# EAGLE design e-Tapperhandpiece (EAGLE 8.2.2)
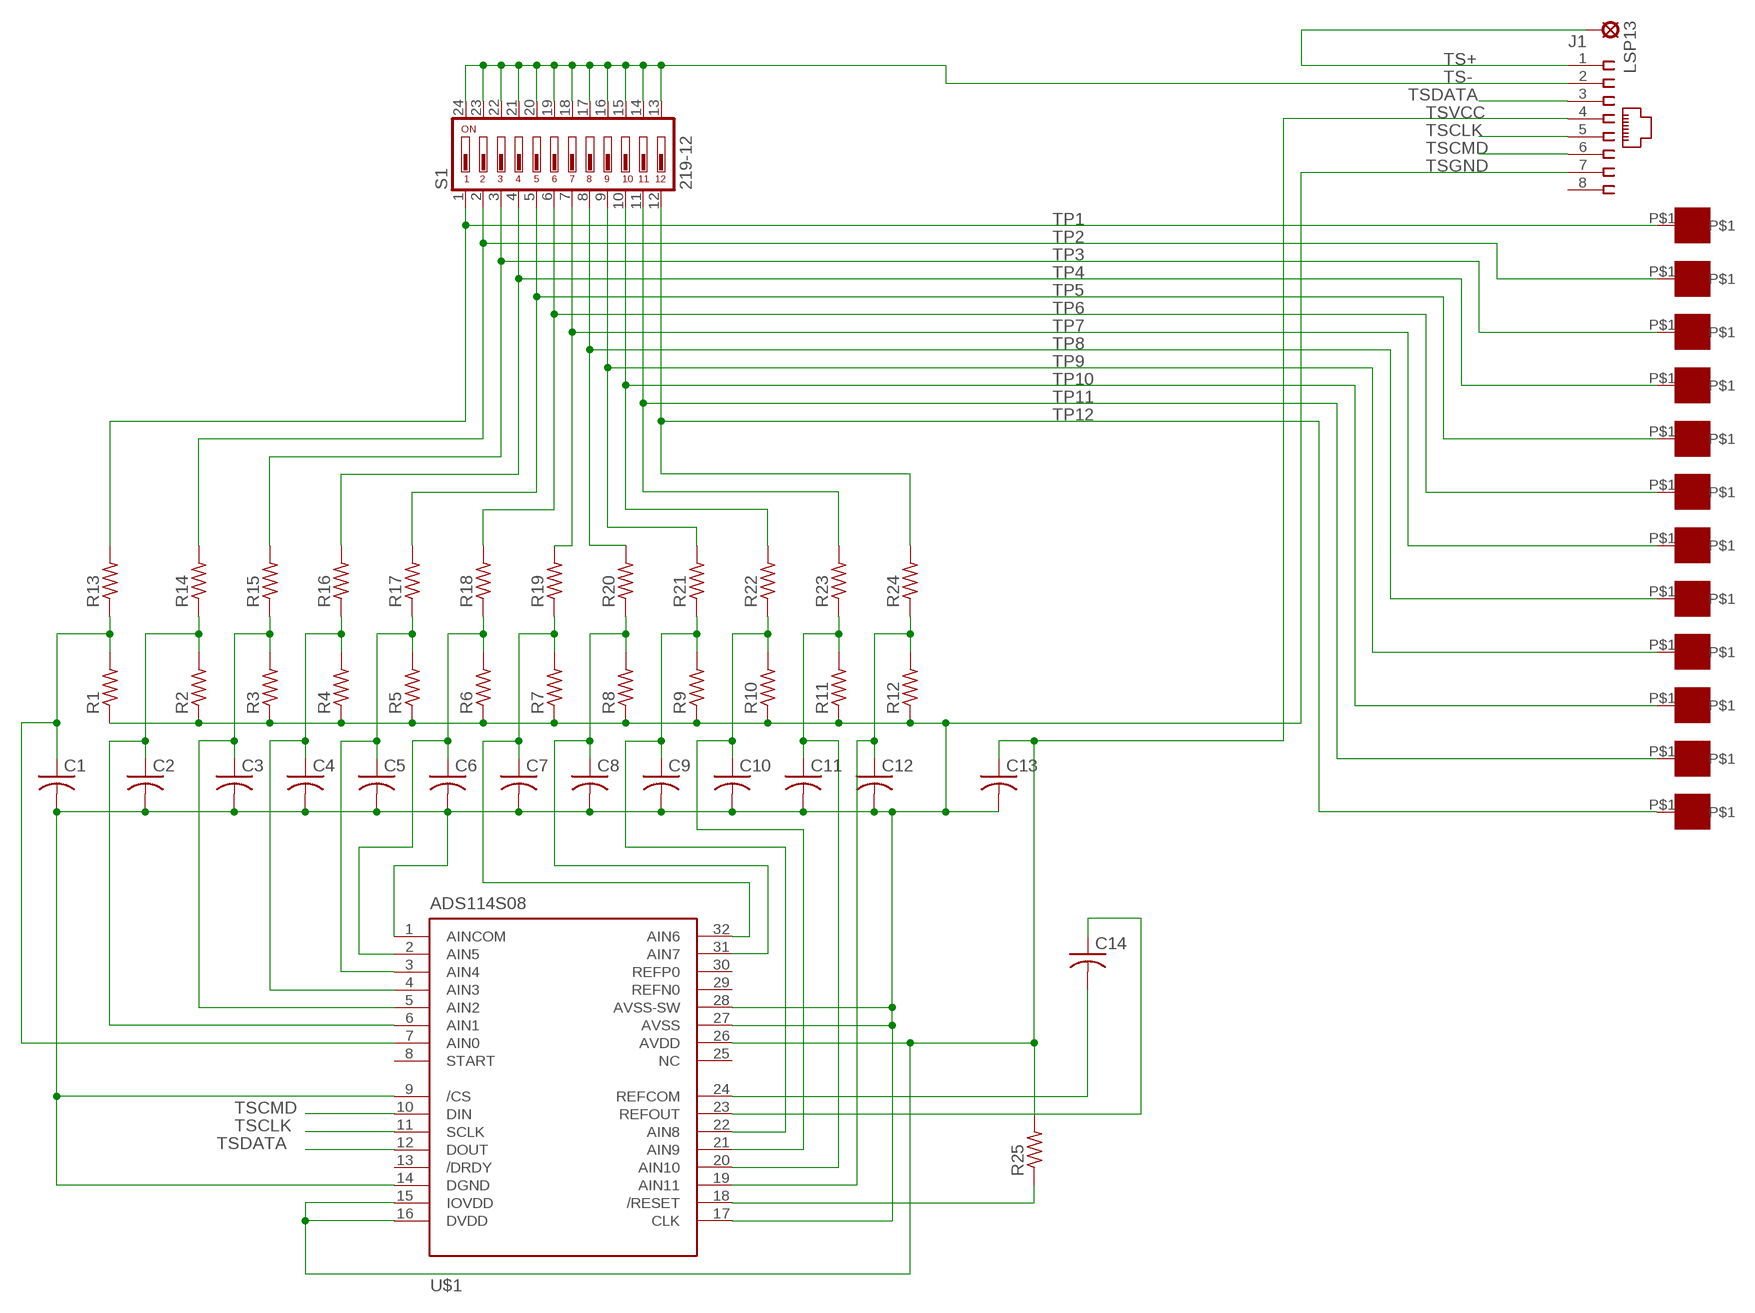
[diagram p0: schematic, sheet 1]

## Parts
C1  C-USC0805  [C0805]
C2  C-USC0805  [C0805]
C3  C-USC0805  [C0805]
C4  C-USC0805  [C0805]
C5  C-USC0805  [C0805]
C6  C-USC0805  [C0805]
C7  C-USC0805  [C0805]
C8  C-USC0805  [C0805]
C9  C-USC0805  [C0805]
C10  C-USC0805  [C0805]
C11  C-USC0805  [C0805]
C12  C-USC0805  [C0805]
C13  C-USC0805  [C0805]
C14  C-USC0805  [C0805]
J1  215877-4  [215877-4]
LSP13  SE11  [SE11]
R1  R-US_R0402  [R0402]
R2  R-US_R0402  [R0402]
R3  R-US_R0402  [R0402]
R4  R-US_R0402  [R0402]
R5  R-US_R0402  [R0402]
R6  R-US_R0402  [R0402]
R7  R-US_R0402  [R0402]
R8  R-US_R0402  [R0402]
R9  R-US_R0402  [R0402]
R10  R-US_R0402  [R0402]
R11  R-US_R0402  [R0402]
R12  R-US_R0402  [R0402]
R13  R-US_R0402  [R0402]
R14  R-US_R0402  [R0402]
R15  R-US_R0402  [R0402]
R16  R-US_R0402  [R0402]
R17  R-US_R0402  [R0402]
R18  R-US_R0402  [R0402]
R19  R-US_R0402  [R0402]
R20  R-US_R0402  [R0402]
R21  R-US_R0402  [R0402]
R22  R-US_R0402  [R0402]
R23  R-US_R0402  [R0402]
R24  R-US_R0402  [R0402]
R25  R-US_R0402  [R0402]
S1  219-12  [CTS-219-12]
TSP1  ET1  [ET1]
TSP2  ET1  [ET1]
TSP3  ET1  [ET1]
TSP4  ET1  [ET1]
TSP5  ET1  [ET1]
TSP6  ET1  [ET1]
TSP7  ET1  [ET1]
TSP8  ET1  [ET1]
TSP9  ET1  [ET1]
TSP10  ET1  [ET1]
TSP11  ET1  [ET1]
TSP12  ET1  [ET1]
U$1  ADS114S08  [TQFP32-08]

## Nets
N$10: R25.1 U$1.18(/RESET)
N$14: C1.1 R1.2 R13.1 U$1.7(AIN0)
N$15: C2.1 R2.2 R14.1 U$1.6(AIN1)
N$16: C3.1 R3.2 R15.1 U$1.5(AIN2)
N$17: C4.1 R4.2 R16.1 U$1.4(AIN3)
N$18: C5.1 R5.2 R17.1 U$1.3(AIN4)
N$19: C6.1 R6.2 R18.1 U$1.2(AIN5)
N$20: C7.1 R7.2 R19.1 U$1.32(AIN6)
N$21: C8.1 R8.2 R20.1 U$1.31(AIN7)
N$22: C9.1 R9.2 R21.1 U$1.22(AIN8)
N$23: C10.1 R10.2 R22.1 U$1.21(AIN9)
N$24: C11.1 R11.2 R23.1 U$1.20(AIN10)
N$25: C12.1 R12.2 R24.1 U$1.19(AIN11)
REFCOM: C14.2 U$1.24(REFCOM)
REFOUT: C14.1 U$1.23(REFOUT)
TP1: R13.2 S1.1 TSP1.P$1
TP2: R14.2 S1.2 TSP2.P$1
TP3: R15.2 S1.3 TSP3.P$1
TP4: R16.2 S1.4 TSP4.P$1
TP5: R17.2 S1.5 TSP5.P$1
TP6: R18.2 S1.6 TSP6.P$1
TP7: R19.2 S1.7 TSP7.P$1
TP8: R20.2 S1.8 TSP8.P$1
TP9: R21.2 S1.9 TSP9.P$1
TP10: R22.2 S1.10 TSP10.P$1
TP11: R23.2 S1.11 TSP11.P$1
TP12: R24.2 S1.12 TSP12.P$1
TS+: J1.1 LSP13.MP
TS-: J1.2 S1.13 S1.14 S1.15 S1.16 S1.17 S1.18 S1.19 S1.20 S1.21 S1.22 S1.23 S1.24
TSCLK: J1.5 U$1.11(SCLK)
TSCMD: J1.6 U$1.10(DIN)
TSDATA: J1.3 U$1.12(DOUT)
TSGND: C1.2 C2.2 C3.2 C4.2 C5.2 C6.2 C7.2 C8.2 C9.2 C10.2 C11.2 C12.2 C13.2 J1.7 R1.1 R2.1 R3.1 R4.1 R5.1 R6.1 R7.1 R8.1 R9.1 R10.1 R11.1 R12.1 U$1.1(AINCOM) U$1.9(/CS) U$1.14(DGND) U$1.17(CLK) U$1.27(AVSS) U$1.28(AVSS-SW)
TSVCC: C13.1 J1.4 R25.2 U$1.15(IOVDD) U$1.16(DVDD) U$1.26(AVDD)
Unconnected: J1.8 U$1.8(START) U$1.13(/DRDY) U$1.25(NC) U$1.29(REFN0) U$1.30(REFP0)

## Library data of the parts
C1-C14 = rcl:C-US: CAPACITOR, American symbol
J1 = con-amp:215877-4: AMP connector
LSP13 = solpad:SE11: SOLDER PAD RTM, drill 1,1mm, distributor Buerklin, 07F810
R1-R25 = resistor:R-US_: RESISTOR, American symbol
S1 = switch-dil:219-12*: Surface Mount DIP Switch Series 219 SMT CTS Electronic Components Sourc: www.ctscorp.com; OC_FARNELL: unknown; OC_NEWARK: unknown
TSP1-TSP12 = ET1:ET1: Through Hold Pads 20 mil drill hole
U$1 = ADS114S08:ADS114S08

## Net classes
0 default: clearance 0.205 mm

## Board
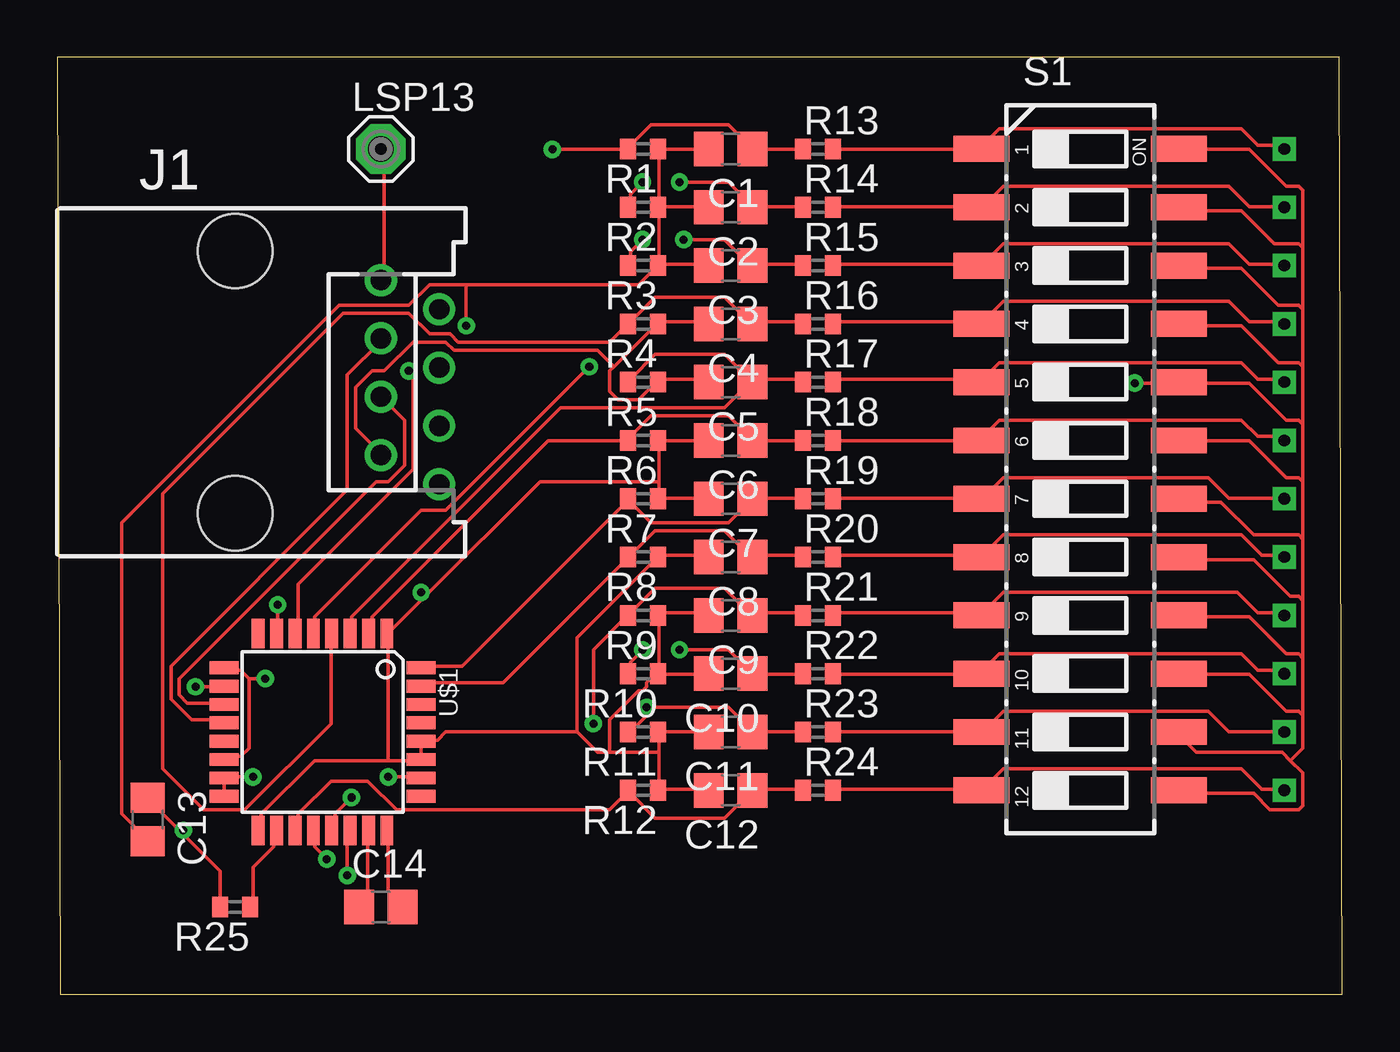
[diagram p1: board, top side]
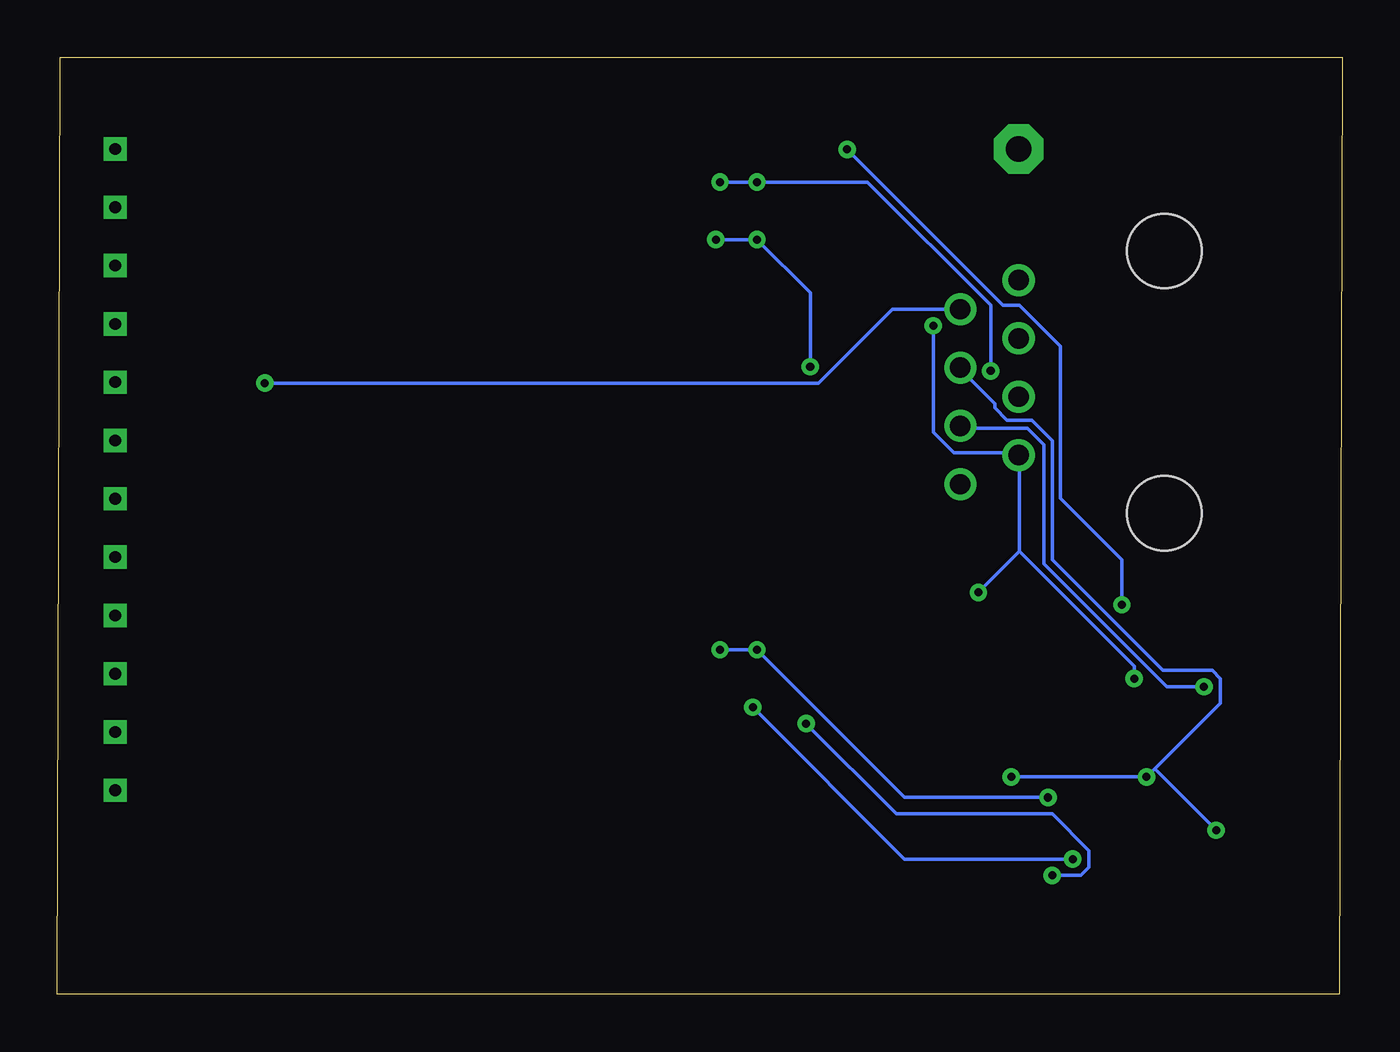
[diagram p2: board, bottom side, seen from below]

Size 55.99 x 40.82 mm. Coordinates in mm from the lower left corner, seen from the top.
Outline: 0.13,0 55.99,0 55.86,40.82 0,40.82 0.13,0
Copper layers (1*16): Top 0.035mm / dielectric 1.5mm / Bottom 0.035mm
Design rules "e-Tapperhandpiece": minimum track width 6mil, minimum drill 0.35mm, track to track 0.205mm, track to pad 0.205mm, pad to pad 0.205mm, via to via 0.205mm, smd to smd 6mil, copper to edge 40mil, drill to drill 6mil, minimum pad ring 10mil, minimum via ring 8mil, stop-mask expansion 4mil, vias tented up to drill 0mil, thermal gap 10mil

### Footprints (pad centres in the part's own frame; a part is rotated, then mirrored left to right if it is on the bottom)
C0805 = smd 1.3 x 1.5: 1 -0.95,0; 2 0.95,0
215877-4 = drill 0.889: 1 -4.445,6.35; 2 -3.175,8.89; 3 -1.905,6.35; 4 -0.635,8.89; 5 0.635,6.35; 6 1.905,8.89; 7 3.175,6.35; 8 4.445,8.89 | hole 3.251: -5.715,0; 5.715,0
SE11 = drill 1.118 pad 2.159 octagon: MP 0,0
R0402 = smd 0.7 x 0.9: 1 -0.65,0; 2 0.65,0
CTS-219-12 = smd 1.13 x 2.44: 1 -13.97,-4.3; 2 -11.43,-4.3; 3 -8.89,-4.3; 4 -6.35,-4.3; 5 -3.81,-4.3; 6 -1.27,-4.3; 7 1.27,-4.3; 8 3.81,-4.3; 9 6.35,-4.3; 10 8.89,-4.3; 11 11.43,-4.3; 12 13.97,-4.3; 13 13.97,4.3; 14 11.43,4.3; 15 8.89,4.3; 16 6.35,4.3; 17 3.81,4.3; 18 1.27,4.3; 19 -1.27,4.3; 20 -3.81,4.3; 21 -6.35,4.3; 22 -8.89,4.3; 23 -11.43,4.3; 24 -13.97,4.3
ET1 = drill 0.508 square: P$1 0,0
TQFP32-08 = smd 1.27 x 0.559: 1 -4.293,2.8; 2 -4.293,2; 3 -4.293,1.2; 4 -4.293,0.4; 5 -4.293,-0.4; 6 -4.293,-1.2; 7 -4.293,-2; 8 -4.293,-2.8; 17 4.293,-2.8; 18 4.293,-2; 19 4.293,-1.2; 20 4.293,-0.4; 21 4.293,0.4; 22 4.293,1.2; 23 4.293,2; 24 4.293,2.8 | smd 0.559 x 1.27: 9 -2.8,-4.293; 10 -2,-4.293; 11 -1.2,-4.293; 12 -0.4,-4.293; 13 0.4,-4.293; 14 1.2,-4.293; 15 2,-4.293; 16 2.8,-4.293; 25 2.8,4.293; 26 2,4.293; 27 1.2,4.293; 28 0.4,4.293; 29 -0.4,4.293; 30 -1.2,4.293; 31 -2,4.293; 32 -2.8,4.293

### Placement (x,y rotation side)
C1  29.34,36.83 180 top
C2  29.34,34.29 180 top
C3  29.34,31.75 180 top
C4  29.34,29.21 180 top
C5  29.34,26.67 180 top
C6  29.34,24.13 180 top
C7  29.34,21.59 180 top
C8  29.34,19.05 180 top
C9  29.34,16.51 180 top
C10  29.34,13.97 180 top
C11  29.34,11.43 180 top
C12  29.34,8.89 180 top
C13  3.94,7.62 270 top
C14  14.1,3.81 0 top
DRILEGEND  [DRILEGEND]  -0.1,-3.81 0 top  (outside the outline)
J1  7.75,26.67 270 top
LSP13  14.1,36.83 0 top
R1  25.53,36.83 180 top
R2  25.53,34.29 180 top
R3  25.53,31.75 180 top
R4  25.53,29.21 180 top
R5  25.53,26.67 180 top
R6  25.53,24.13 180 top
R7  25.53,21.59 180 top
R8  25.53,19.05 180 top
R9  25.53,16.51 180 top
R10  25.53,13.97 180 top
R11  25.53,11.43 180 top
R12  25.53,8.89 180 top
R13  33.15,36.83 0 top
R14  33.15,34.29 0 top
R15  33.15,31.75 0 top
R16  33.15,29.21 0 top
R17  33.15,26.67 0 top
R18  33.15,24.13 0 top
R19  33.15,21.59 0 top
R20  33.15,19.05 0 top
R21  33.15,16.51 0 top
R22  33.15,13.97 0 top
R23  33.15,11.43 0 top
R24  33.15,8.89 0 top
R25  7.75,3.81 180 top
S1  44.58,22.86 270 top
TSP1  53.47,36.83 0 top
TSP2  53.47,34.29 0 top
TSP3  53.47,31.75 0 top
TSP4  53.47,29.21 0 top
TSP5  53.47,26.67 0 top
TSP6  53.47,24.13 0 top
TSP7  53.47,21.59 0 top
TSP8  53.47,19.05 0 top
TSP9  53.47,16.51 0 top
TSP10  53.47,13.97 0 top
TSP11  53.47,11.43 0 top
TSP12  53.47,8.89 0 top
U$1  11.56,11.43 270 top

### Tracks (layer width: path | path; a pad name or v marks a point on that pad's centre or on a via)
N$10
  Top 0.152: R25.1 8.53,3.93 8.53,5.54 9.42,6.43 9.42,6.97 U$1.18
N$14  (via drill 0.35)
  Top 0.152: R13.1 32.47,36.81 30.33,36.81 C1.1 30.15,36.99 29.25,37.88 25.86,37.88 24.97,36.99 R1.2 24.79,36.81 v21.57,36.81 | v9.6,16.98 9.6,15.73 U$1.7
  Bottom 0.152: v9.6,16.98 9.6,18.94 12.28,21.62 12.28,28.23 14.07,30.02 14.78,30.02 v21.57,36.81
N$15  (via drill 0.35)
  Top 0.152: v25.5,35.38 24.97,34.85 24.97,34.31 R2.2 | v27.11,35.38 29.25,35.38 30.33,34.31 | 30.33,34.31 32.47,34.31 R14.1 | 30.33,34.31 C2.1 | v15.32,27.16 15.5,26.98 15.5,22.87 10.49,17.87 10.49,15.73 U$1.6
  Bottom 0.152: v27.11,35.38 v25.5,35.38 20.68,35.38 15.32,30.02 v15.32,27.16
N$16  (via drill 0.35)
  Top 0.152: v25.5,32.88 24.97,32.34 24.97,31.81 R3.2 | v27.29,32.88 29.08,32.88 30.15,31.81 C3.1 30.33,31.81 32.47,31.81 R15.1 | v23.18,27.34 16.92,21.09 15.85,21.09 11.21,16.44 11.21,15.73 U$1.5
  Bottom 0.152: v27.29,32.88 v25.5,32.88 23.18,30.56 v23.18,27.34
N$17
  Top 0.152: R16.1 32.47,29.31 30.33,29.31 C4.1 30.15,29.31 29.08,30.38 26.04,30.38 24.97,29.31 R4.2 24.79,29.13 24.07,28.41 17.46,28.41 17.1,28.77 16.21,28.77 15.32,29.66 12.46,29.66 4.59,21.8 4.59,9.83 6.38,8.04 8.17,8.04 11.92,11.79 11.92,15.55 U$1.4
N$18
  Top 0.152: R5.2 24.97,26.8 26.04,27.88 29.08,27.88 30.15,26.8 C5.1 | R17.1 32.47,26.8 30.33,26.8 C5.1 | U$1.3 12.82,15.73 12.82,16.44 21.93,25.55 29.08,25.55 30.15,26.63 C5.1
N$19
  Top 0.152: R18.1 32.47,24.12 30.33,24.12 C6.1 30.15,24.3 29.25,25.2 25.86,25.2 24.97,24.3 R6.2 24.79,24.12 21.39,24.12 13.71,16.44 13.71,15.73 U$1.2
N$20
  Top 0.152: R19.1 32.47,21.62 30.33,21.62 C7.1 30.15,21.44 29.25,20.55 25.86,20.55 24.97,21.44 R7.2 24.79,21.44 17.64,14.3 15.85,14.3 U$1.32
N$21
  Top 0.152: R20.1 32.47,19.12 30.33,19.12 C8.1 30.15,19.12 29.08,20.19 26.04,20.19 24.97,19.12 R8.2 24.79,18.94 19.43,13.58 15.85,13.58 U$1.31
N$22  (via drill 0.35)
  Top 0.152: R21.1 32.47,16.62 30.33,16.62 C9.1 30.15,16.62 29.08,17.69 26.04,17.69 24.97,16.62 R9.2 24.79,16.44 23.36,15.01 v23.36,11.79 | v12.64,5.18 12.64,6.97 U$1.22
  Bottom 0.152: v12.64,5.18 11.38,5.18 11.03,5.54 11.03,6.25 12.64,7.86 19.43,7.86 v23.36,11.79
N$23  (via drill 0.35)
  Top 0.152: v25.5,15.01 24.97,14.47 24.97,14.12 R10.2 | v27.11,15.01 29.25,15.01 30.15,14.12 C10.1 30.33,13.94 32.47,13.94 R22.1 | v12.82,8.58 12.1,7.86 12.1,7.15 U$1.21
  Bottom 0.152: v27.11,15.01 v25.5,15.01 19.07,8.58 v12.82,8.58
N$24  (via drill 0.35)
  Top 0.152: 25.86,12.33 26.04,12.51 29.25,12.51 30.33,11.44 | 25.86,12.33 24.97,11.44 R11.2 | 30.33,11.44 32.47,11.44 R23.1 | 30.33,11.44 C11.1 | v11.74,5.9 11.21,6.43 11.21,6.97 U$1.20 | 25.86,12.33 v25.68,12.51
  Bottom 0.152: v11.74,5.9 19.07,5.9 v25.68,12.51
N$25
  Top 0.152: R24.1 32.47,8.94 30.33,8.94 C12.1 30.15,8.76 29.08,7.68 26.04,7.68 24.97,8.76 R12.2 24.79,8.76 24.07,8.04 14.78,8.04 13.53,9.29 11.92,9.29 10.49,7.86 10.49,7.15 U$1.19
REFCOM
  Top 0.152: U$1.24 14.42,6.97 14.42,4.47 14.96,3.93 C14.2
REFOUT
  Top 0.152: U$1.23 13.53,6.97 13.53,4.29 13.17,3.93 C14.1
TP1
  Top 0.152: R13.2 33.9,36.81 40.16,36.81 S1.1 40.34,36.99 41.05,37.71 51.59,37.71 52.31,36.99 53.38,36.99 TSP1.P$1
TP2
  Top 0.152: R14.2 33.9,34.31 40.16,34.31 S1.2 40.34,34.31 41.23,35.2 51.06,35.2 51.95,34.31 53.38,34.31 TSP2.P$1
TP3
  Top 0.152: R15.2 33.9,31.81 40.16,31.81 S1.3 40.34,31.81 41.23,32.7 51.06,32.7 51.95,31.81 53.38,31.81 TSP3.P$1
TP4
  Top 0.152: R16.2 33.9,29.31 40.16,29.31 S1.4 40.34,29.31 41.23,30.2 51.06,30.2 51.95,29.31 53.38,29.31 TSP4.P$1
TP5
  Top 0.152: R17.2 33.9,26.8 40.16,26.8 S1.5 40.34,26.8 41.05,27.52 51.59,27.52 52.31,26.8 53.38,26.8 TSP5.P$1
TP6
  Top 0.152: R18.2 33.9,24.12 40.16,24.12 S1.6 40.34,24.3 41.05,25.02 51.59,25.02 52.31,24.3 53.38,24.3 TSP6.P$1
TP7
  Top 0.152: R19.2 33.9,21.62 40.16,21.62 S1.7 40.34,21.62 41.23,22.52 50.16,22.52 51.06,21.62 53.38,21.62 TSP7.P$1
TP8
  Top 0.152: R20.2 33.9,19.12 40.16,19.12 S1.8 40.34,19.12 41.23,20.01 51.59,20.01 52.49,19.12 53.38,19.12 TSP8.P$1
TP9
  Top 0.152: R21.2 33.9,16.62 40.16,16.62 S1.9 40.34,16.62 41.23,17.51 51.41,17.51 52.31,16.62 53.38,16.62 TSP9.P$1
TP10
  Top 0.152: R22.2 33.9,13.94 40.16,13.94 S1.10 40.34,14.12 41.05,14.83 51.59,14.83 52.31,14.12 53.38,14.12 TSP10.P$1
TP11
  Top 0.152: R23.2 33.9,11.44 40.16,11.44 S1.11 40.34,11.44 41.23,12.33 50.16,12.33 51.06,11.44 53.38,11.44 TSP11.P$1
TP12
  Top 0.152: R24.2 33.9,8.94 40.16,8.94 S1.12 40.34,8.94 41.23,9.83 51.59,9.83 52.49,8.94 53.38,8.94 TSP12.P$1
TS+
  Top 0.152: J1.1 14.24,31.27 14.24,36.81 LSP13.MP
TS-  (via drill 0.35)
  Top 0.152: 48.91,24.09 S1.19 48.91,24.12 51.95,24.12 53.56,22.52 54.09,22.52 54.27,22.34 | 48.91,21.59 S1.18 48.91,21.44 50.7,21.44 52.13,20.01 54.09,20.01 54.27,19.84 | 48.91,31.78 S1.22 48.91,31.63 51.59,31.63 53.2,30.02 54.09,30.02 54.27,29.84 | 48.91,34.28 S1.23 48.91,34.13 51.59,34.13 53.02,32.7 54.09,32.7 54.27,32.52 | 53.74,10.19 53.38,10.54 49.63,10.54 48.91,11.26 S1.14 | 53.74,10.19 54.27,9.65 54.27,8.22 54.09,8.04 52.84,8.04 52.13,8.76 48.91,8.76 S1.13 | 54.27,12.15 54.09,12.33 53.56,12.33 51.95,13.94 48.91,13.94 S1.15 | 54.27,12.15 54.27,10.72 53.74,10.19 | 54.27,14.65 54.09,14.83 53.56,14.83 51.95,16.44 48.91,16.44 S1.16 | 54.27,12.15 54.27,14.65 | 54.27,17.16 54.09,17.33 53.74,17.33 52.13,18.94 48.91,18.94 S1.17 | 54.27,14.65 54.27,17.16 | 54.27,17.16 54.27,19.84 | 54.27,19.84 54.27,22.34 | 54.27,24.84 54.09,25.02 53.56,25.02 51.95,26.63 48.91,26.63 S1.20 48.73,26.63 v46.95,26.63 | 54.27,22.34 54.27,24.84 | 54.27,27.34 54.09,27.52 53.2,27.52 51.59,29.13 48.91,29.13 S1.21 | 54.27,24.84 54.27,27.34 | 54.27,27.34 54.27,29.84 | 54.27,29.84 54.27,32.52 | 54.27,32.52 54.27,35.02 54.09,35.2 53.56,35.2 51.95,36.81 48.91,36.81 S1.24
  Bottom 0.152: v46.95,26.63 22.82,26.63 19.61,29.84 16.75,29.84 J1.2
TSCLK
  Top 0.152: U$1.11 7.1,12.69 5.67,12.69 5.31,13.04 5.31,13.76 13.89,22.34 14.42,22.34 15.14,23.05 15.14,25.02 14.24,25.91 J1.5
TSCMD  (via drill 0.35)
  Top 0.152: v6.02,13.4 7.1,13.4 U$1.10
  Bottom 0.152: v6.02,13.4 7.63,13.4 12.99,18.76 12.99,23.95 13.71,24.66 16.57,24.66 J1.6
TSDATA
  Top 0.152: U$1.12 7.1,11.97 5.84,11.97 4.95,12.87 4.95,14.3 12.64,21.98 12.64,26.98 14.07,28.41 J1.3
TSGND  (via drill 0.35)
  Top 0.152: R10.1 26.22,13.94 28.36,13.94 C10.2 | C9.2 28.36,16.62 26.22,16.62 R9.1 26.22,16.44 26.22,14.12 R10.1 | C8.2 28.36,19.12 26.22,19.12 R8.1 26.04,18.94 22.64,15.55 22.64,11.44 | 26.22,8.94 28.36,8.94 C12.2 | C11.2 28.36,11.44 26.22,11.44 R11.1 26.22,11.26 26.22,10.54 | 26.22,10.54 26.22,8.94 | 26.22,8.94 R12.1 | 22.64,11.44 23.54,10.54 24.07,10.54 | 26.22,10.54 24.07,10.54 | 24.07,10.54 24.07,11.97 25.32,13.22 25.5,13.22 25.68,13.4 25.68,13.58 26.04,13.94 R10.1 | 26.22,21.62 28.36,21.62 C7.2 | 26.22,24.12 28.36,24.12 C6.2 | 26.22,24.12 26.22,22.34 | 26.22,22.34 26.22,21.62 | 26.22,21.62 R7.1 | 26.22,24.12 R6.1 | 14.42,10.19 15.67,10.19 U$1.27 15.85,10.37 15.85,10.9 U$1.28 15.85,11.08 16.57,11.08 16.92,11.44 22.64,11.44 | 14.42,10.19 11.21,10.19 8.88,7.86 8.88,7.15 U$1.17 | 14.42,10.19 14.42,15.55 U$1.1 14.42,15.73 16.03,17.33 | 26.22,22.34 21.04,22.34 16.03,17.33 | C5.2 28.36,26.8 26.22,26.8 R5.1 26.04,26.63 25.32,25.91 24.43,25.91 24.07,26.27 24.07,27.16 24.25,27.34 | C4.2 28.36,29.31 26.22,29.31 R4.1 26.04,29.13 24.25,27.34 | 8.35,13.76 8.35,10.72 7.99,10.37 7.27,10.37 U$1.14 | 8.35,13.76 7.99,14.12 7.27,14.12 U$1.9 | v9.06,13.76 8.35,13.76 | 24.25,27.34 23.54,28.06 17.28,28.06 16.92,28.41 15.5,28.41 14.24,27.16 13.71,27.16 12.99,26.45 12.99,24.66 14.07,23.59 J1.7 | v15.85,17.51 16.03,17.33 | 26.22,36.81 28.36,36.81 C1.2 | 26.22,34.31 28.36,34.31 C2.2 | 26.22,31.81 28.36,31.81 C3.2 | 17.82,30.91 25.32,30.91 26.04,31.63 R3.1 26.22,31.81 | 17.82,30.91 16.21,30.91 15.32,30.02 12.28,30.02 2.81,20.55 2.81,7.86 3.88,6.79 C13.2 | 26.22,31.81 26.22,34.13 R2.1 26.22,34.31 | 26.22,34.31 26.22,36.81
  Top 0.152: 26.22,36.81 R1.1 | 17.82,30.91 v17.82,29.13
  Bottom 0.152: v9.06,13.76 9.06,14.3 14.07,19.3 | 14.07,19.3 14.07,23.41 J1.7 14.24,23.59 16.92,23.59 17.82,24.48 v17.82,29.13 | 14.07,19.3 v15.85,17.51
TSVCC  (via drill 0.35)
  Top 0.152: 5.49,6.97 4.06,8.4 C13.1 | 5.49,6.97 7.1,5.36 7.1,3.93 R25.2 | U$1.16 7.27,8.76 7.27,9.29 U$1.15 7.27,9.47 v8.53,9.47 | v14.42,9.47 15.67,9.47 U$1.26 | v5.49,7.15 5.49,6.97
  Bottom 0.152: v14.42,9.47 v8.53,9.47 8.17,9.83 | 8.17,9.83 5.31,12.69 5.31,13.76 5.67,14.12 7.81,14.12 12.64,18.94 12.64,24.12 13.53,25.02 14.6,25.02 15.14,25.55 15.14,25.73 16.57,27.16 J1.4 | 8.17,9.83 v5.49,7.15

### Text on the board
DrillLegend: LAYER-STACK
DrillLegend_01-16: 01-16
DrillLegend_01-20: 01-20